# EAGLE design motores (EAGLE 7.7.0)
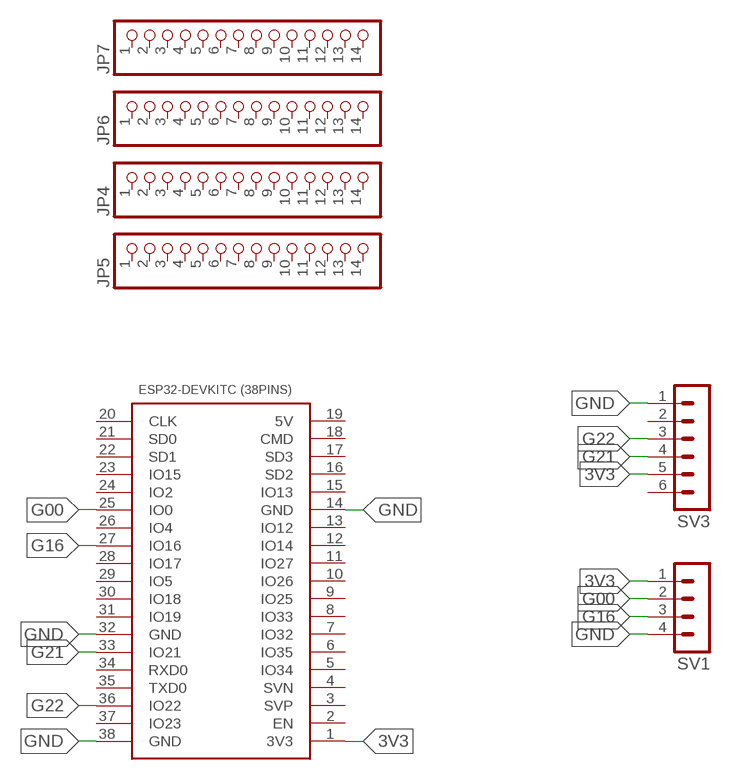
[diagram p0: schematic, sheet 1]

## Parts
ESP32-DEVKITC(38PINS)1  ESP32DEVKITC_38PINS  [ESP32-DEVKITC]
JP4  PINHD-1X14  [1X14]
JP5  PINHD-1X14  [1X14]
JP6  PINHD-1X14  [1X14]
JP7  PINHD-1X14  [1X14]
SV1  MA04-1  [MA04-1]
SV3  MA06-1  [MA06-1]

## Nets
3V3: ESP32-DEVKITC(38PINS)1.1(3V3) SV1.1 SV3.5
G00: ESP32-DEVKITC(38PINS)1.25(IO0) SV1.2
G16: ESP32-DEVKITC(38PINS)1.27(IO16) SV1.3
G21: ESP32-DEVKITC(38PINS)1.33(IO21) SV3.4
G22: ESP32-DEVKITC(38PINS)1.36(IO22) SV3.3
GND: ESP32-DEVKITC(38PINS)1.14(GND) ESP32-DEVKITC(38PINS)1.32(GND) ESP32-DEVKITC(38PINS)1.38(GND) SV1.4 SV3.1
Unconnected: ESP32-DEVKITC(38PINS)1.2(EN) ESP32-DEVKITC(38PINS)1.3(SVP) ESP32-DEVKITC(38PINS)1.4(SVN) ESP32-DEVKITC(38PINS)1.5(IO34) ESP32-DEVKITC(38PINS)1.6(IO35) ESP32-DEVKITC(38PINS)1.7(IO32) ESP32-DEVKITC(38PINS)1.8(IO33) ESP32-DEVKITC(38PINS)1.9(IO25) ESP32-DEVKITC(38PINS)1.10(IO26) ESP32-DEVKITC(38PINS)1.11(IO27) ESP32-DEVKITC(38PINS)1.12(IO14) ESP32-DEVKITC(38PINS)1.13(IO12) ESP32-DEVKITC(38PINS)1.15(IO13) ESP32-DEVKITC(38PINS)1.16(SD2) ESP32-DEVKITC(38PINS)1.17(SD3) ESP32-DEVKITC(38PINS)1.18(CMD) ESP32-DEVKITC(38PINS)1.19(5V) ESP32-DEVKITC(38PINS)1.20(CLK) ESP32-DEVKITC(38PINS)1.21(SD0) ESP32-DEVKITC(38PINS)1.22(SD1) ESP32-DEVKITC(38PINS)1.23(IO15) ESP32-DEVKITC(38PINS)1.24(IO2) ESP32-DEVKITC(38PINS)1.26(IO4) ESP32-DEVKITC(38PINS)1.28(IO17) ESP32-DEVKITC(38PINS)1.29(IO5) ESP32-DEVKITC(38PINS)1.30(IO18) ESP32-DEVKITC(38PINS)1.31(IO19) ESP32-DEVKITC(38PINS)1.34(RXD0) ESP32-DEVKITC(38PINS)1.35(TXD0) ESP32-DEVKITC(38PINS)1.37(IO23) JP4.1 JP4.2 JP4.3 JP4.4 JP4.5 JP4.6 JP4.7 JP4.8 JP4.9 JP4.10 JP4.11 JP4.12 JP4.13 JP4.14 JP5.1 JP5.2 JP5.3 JP5.4 JP5.5 JP5.6 JP5.7 JP5.8 JP5.9 JP5.10 JP5.11 JP5.12 JP5.13 JP5.14 JP6.1 JP6.2 JP6.3 JP6.4 JP6.5 JP6.6 JP6.7 JP6.8 JP6.9 JP6.10 JP6.11 JP6.12 JP6.13 JP6.14 JP7.1 JP7.2 JP7.3 JP7.4 JP7.5 JP7.6 JP7.7 JP7.8 JP7.9 JP7.10 JP7.11 JP7.12 JP7.13 JP7.14 SV3.2 SV3.6

## Library data of the parts
ESP32-DEVKITC(38PINS)1 = ESP32-DEVKITC(38PINS):ESP32DEVKITC
JP4-JP7 = adafruit:PINHD-1X14: PIN HEADER
SV1 = con-lstb:MA04-1: PIN HEADER; OC_FARNELL: unknown; OC_NEWARK: unknown
SV3 = con-lstb:MA06-1: PIN HEADER; OC_FARNELL: unknown; OC_NEWARK: unknown

## Board
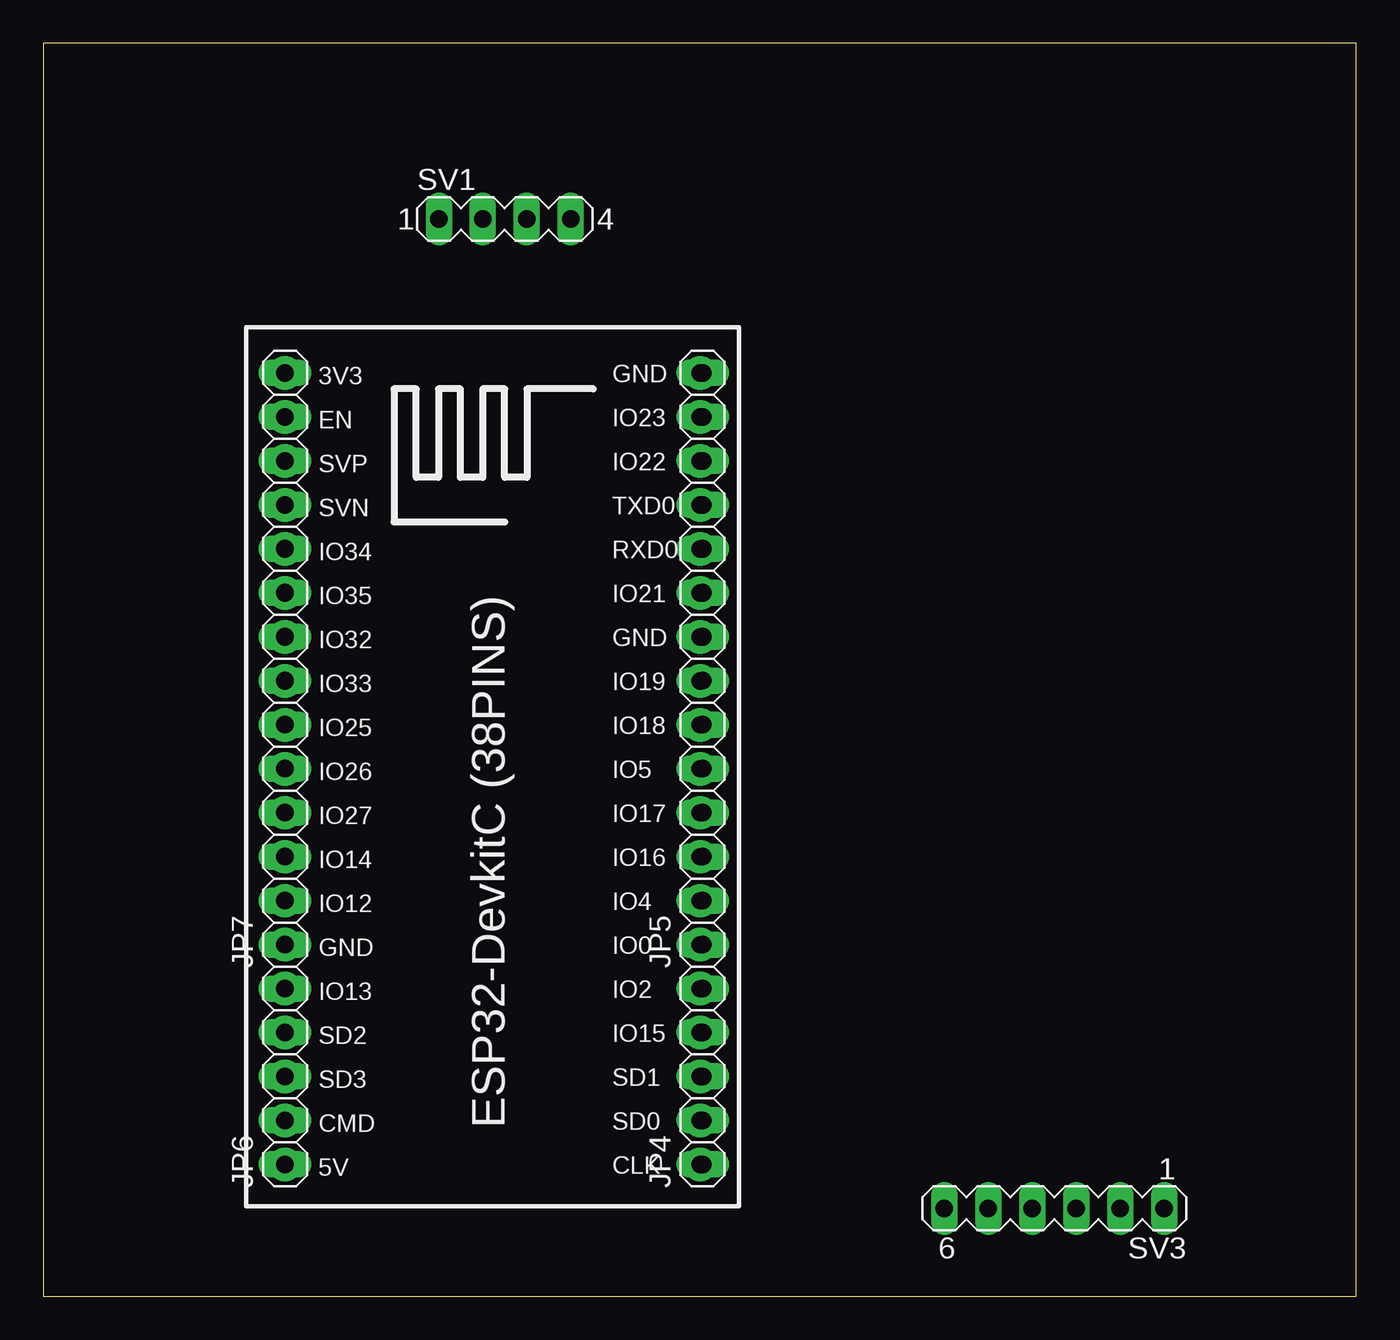
[diagram p1: board, top side]
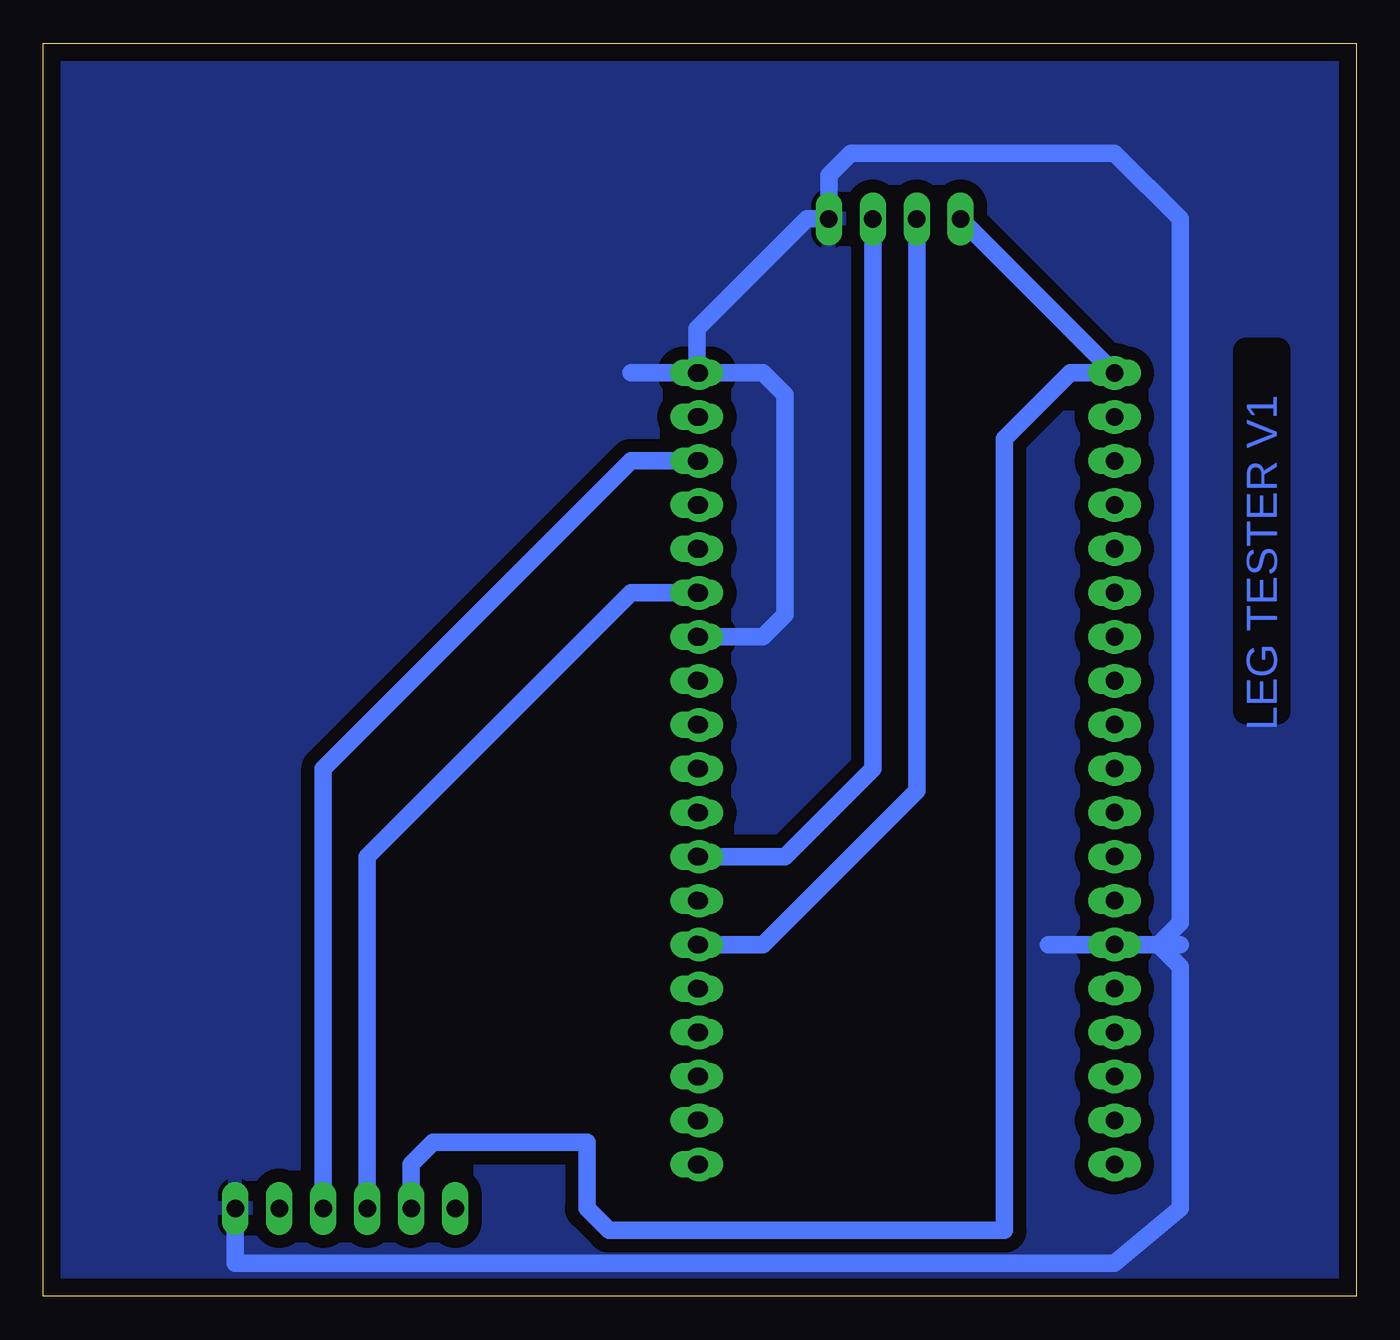
[diagram p2: board, bottom side, seen from below]

Size 75.87 x 72.38 mm. Coordinates in mm from the lower left corner, seen from the top.
Outline: 0,0 75.87,0 75.87,72.38 0,72.38 0,0
Copper layers (1*16): Top 0.035mm / dielectric 1.5mm / Bottom 0.035mm
Design rules "default *": minimum track width 32mil, minimum drill 24mil, track to track 30mil, track to pad 30mil, pad to pad 30mil, via to via 30mil, smd to smd 30mil, copper to edge 40mil, drill to drill 8mil, minimum pad ring 10mil, minimum via ring 8mil, stop-mask expansion 4mil, vias tented up to drill 0mil, thermal gap 10mil

### Footprints (pad centres in the part's own frame; a part is rotated, then mirrored left to right if it is on the bottom)
ESP32-DEVKITC = drill 1 pad 1.93: 1 0.01,0; 2 2.55,0; 3 5.09,0; 4 7.63,0; 5 10.17,0; 6 12.71,0; 7 15.25,0; 8 17.79,0; 9 20.33,0; 10 22.87,0; 11 25.41,0; 12 27.95,0; 13 30.49,0; 14 33.03,0; 15 35.57,0; 16 38.11,0; 17 40.65,0; 18 43.19,0; 19 45.73,0; 20 45.73,24; 21 43.19,24; 22 40.65,24; 23 38.11,24; 24 35.57,24; 25 33.03,24; 26 30.49,24; 27 27.95,24; 28 25.41,24; 29 22.87,24; 30 20.33,24; 31 17.79,24; 32 15.25,24; 33 12.71,24; 34 10.17,24; 35 7.63,24; 36 5.09,24; 37 2.55,24; 38 0,24
1X14 = drill 1.016 long: 1 -16.51,0; 2 -13.97,0; 3 -11.43,0; 4 -8.89,0; 5 -6.35,0; 6 -3.81,0; 7 -1.27,0; 8 1.27,0; 9 3.81,0; 10 6.35,0; 11 8.89,0; 12 11.43,0; 13 13.97,0; 14 16.51,0
MA04-1 = drill 1.016 long: 1 -3.81,0; 2 -1.27,0; 3 1.27,0; 4 3.81,0
MA06-1 = drill 1.016 long: 1 -6.35,0; 2 -3.81,0; 3 -1.27,0; 4 1.27,0; 5 3.81,0; 6 6.35,0

### Placement (x,y rotation side)
ESP32-DEVKITC(38PINS)1  13.97,53.34 270 top
JP4  38.1,24.13 90 top
JP5  38.1,36.83 90 top
JP6  13.97,24.13 90 top
JP7  13.97,36.83 90 top
SV1  26.67,62.23 0 top
SV3  58.42,5.08 180 top

### Tracks (layer width: path | path; a pad name or v marks a point on that pad's centre or on a via)
3V3
  Bottom 1.016: SV1.1 ESP32-DEVKITC(38PINS)1.1 16.51,53.34 20.32,49.53 20.32,3.81 43.18,3.81 44.45,5.08 44.45,8.89 53.34,8.89 54.61,7.62 SV3.5
G00
  Bottom 1.016: SV1.2 25.4,29.21 34.29,20.32 ESP32-DEVKITC(38PINS)1.25
G16
  Bottom 1.016: SV1.3 27.94,30.48 33.02,25.4 ESP32-DEVKITC(38PINS)1.27
G21
  Bottom 1.016: SV3.4 57.15,25.4 41.91,40.64 ESP32-DEVKITC(38PINS)1.33
G22
  Bottom 1.016: SV3.3 59.69,30.48 41.91,48.26 ESP32-DEVKITC(38PINS)1.36
GND
  Bottom 0.813: ESP32-DEVKITC(38PINS)1.32
  Bottom 1.016: ESP32-DEVKITC(38PINS)1.38 38.1,53.47 38.1,55.88 31.75,62.23 SV1.4 30.48,64.77 29.21,66.04 13.97,66.04 10.16,62.23 10.16,21.59 11.43,20.32 | ESP32-DEVKITC(38PINS)1.32 34.29,38.1 33.02,39.37 33.02,52.07 34.29,53.34 ESP32-DEVKITC(38PINS)1.38 | SV3.1 64.77,1.91 13.97,1.91 10.16,5.08 10.16,19.03 11.44,20.31 11.43,20.32 | ESP32-DEVKITC(38PINS)1.38 41.91,53.34 | ESP32-DEVKITC(38PINS)1.14 17.77,20.31 17.78,20.32 11.43,20.32 | 10.16,20.32 11.43,20.32
  pour Bottom: 0,0 76.2,0 76.2,72.39 0,72.39

### Text on the board
Bottom: LEG TESTER V1 🐧